# EAGLE schematic openmv-ble (EAGLE 6.1)
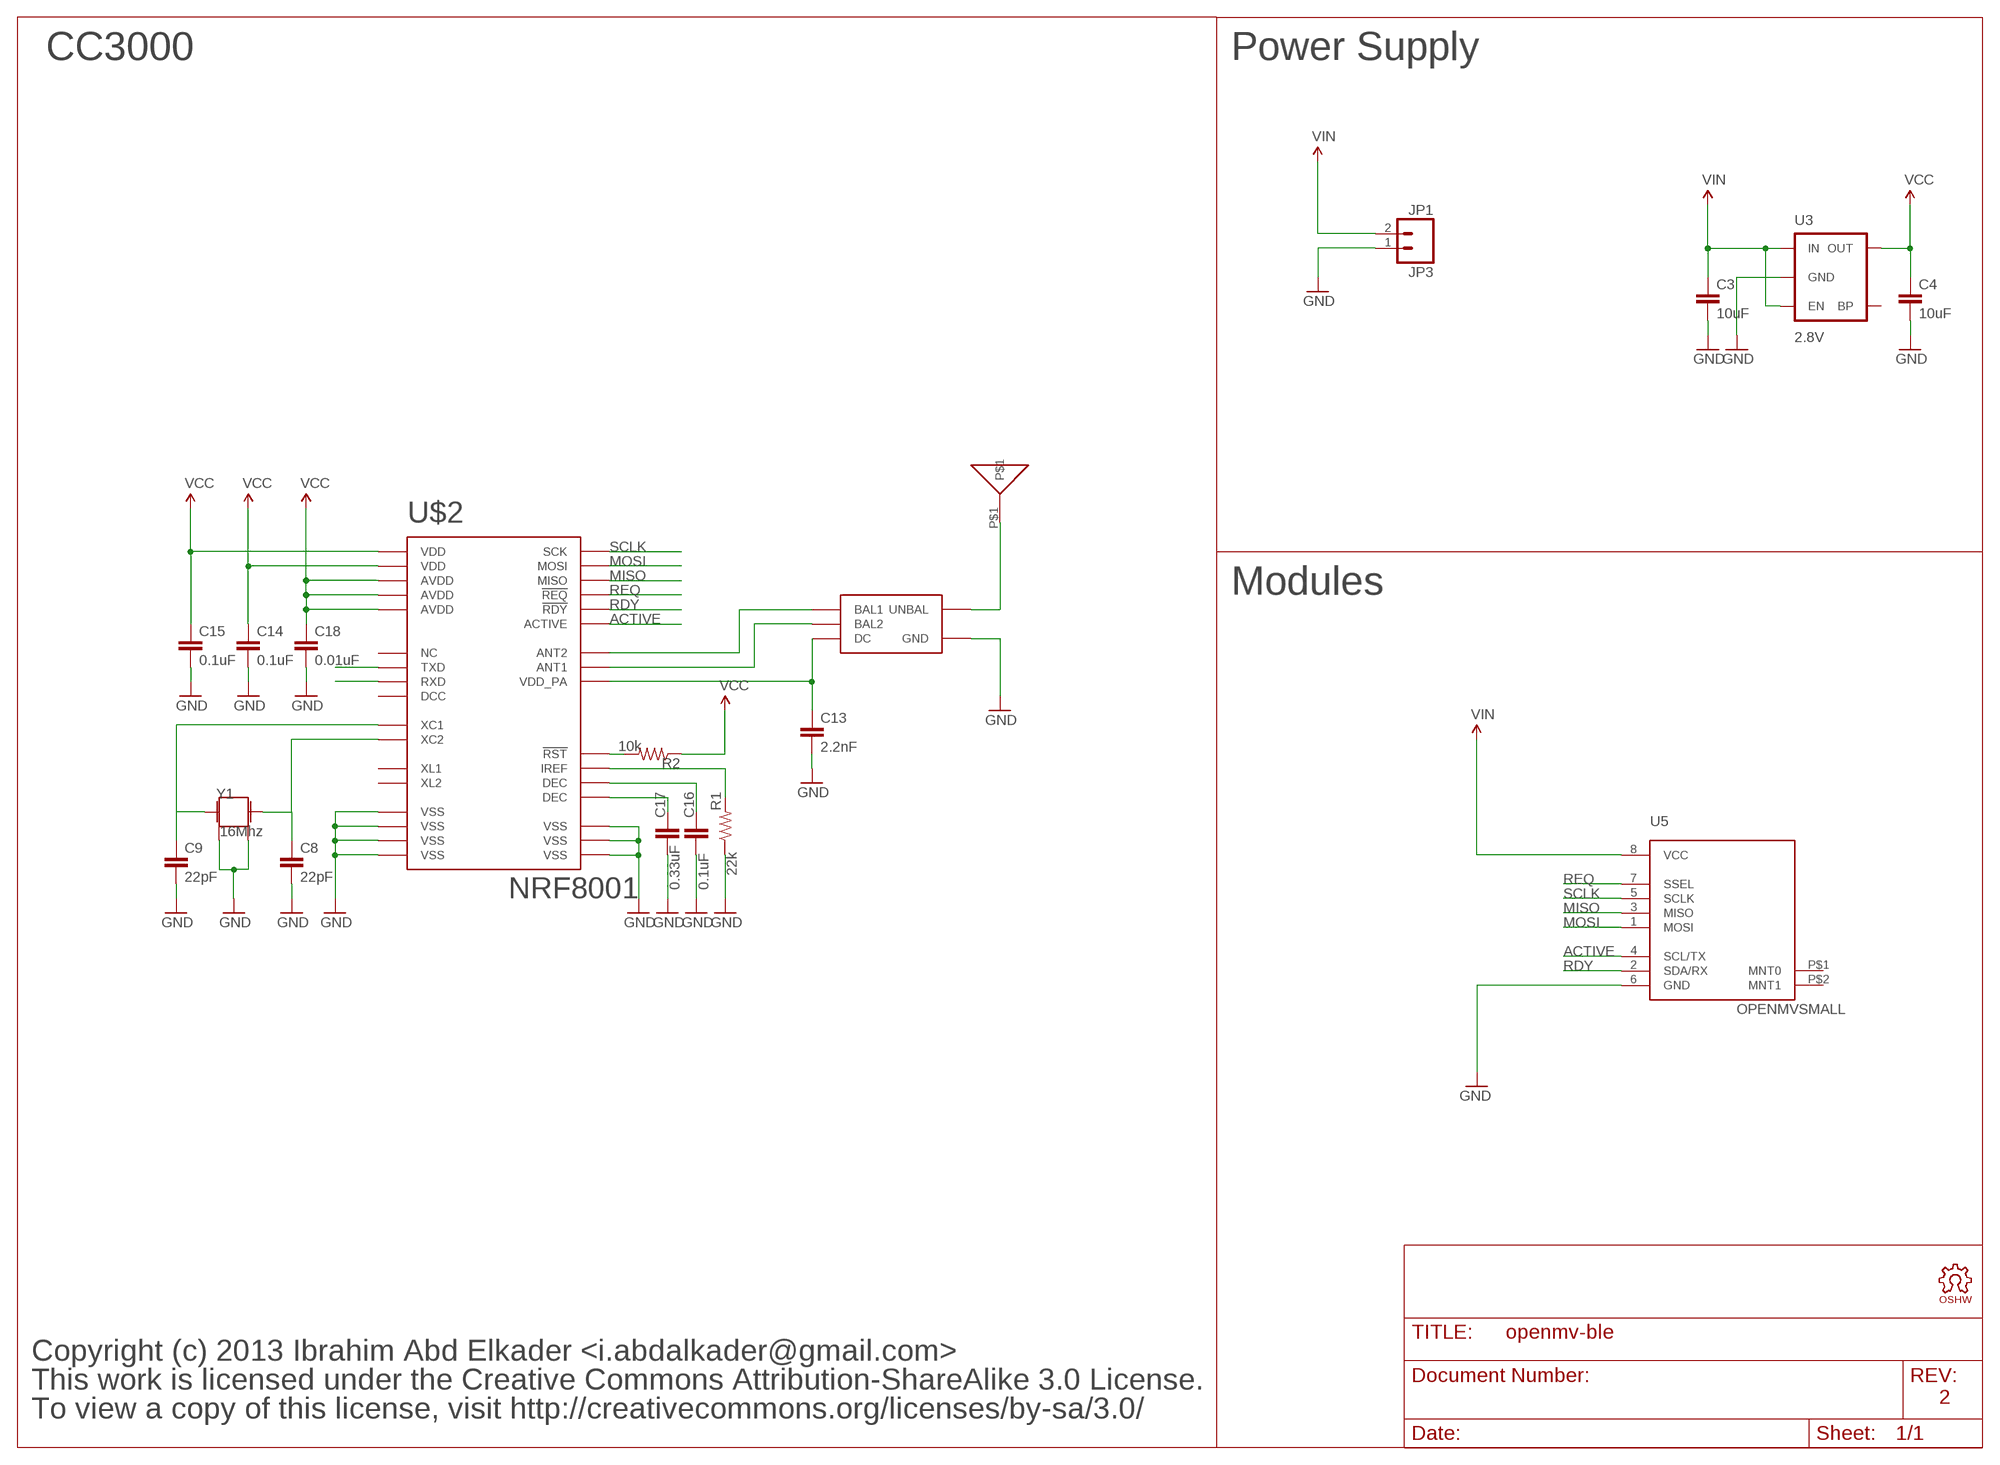
[diagram p0: schematic, sheet 1]

## Parts
C3  10uF  CAP0805  [0805]
C4  10uF  CAP0805  [0805]
C8  22pF  CAP0402-CAP  [0402-CAP]
C9  22pF  CAP0402-CAP  [0402-CAP]
C13  2.2nF  CAP0402-CAP  [0402-CAP]
C14  0.1uF  CAP0402-CAP  [0402-CAP]
C15  0.1uF  CAP0402-CAP  [0402-CAP]
C16  0.1uF  CAP0402-CAP  [0402-CAP]
C17  0.33uF  CAP0402-CAP  [0402-CAP]
C18  0.01uF  CAP0402-CAP  [0402-CAP]
JP1  JP3  M02JST-PTH-2  [JST-2-PTH]
LOGO1  OSHW_LOGO_FILLX0100-NT  [OSHW_FILLX100_NOTEXT]
R1  22k  RESISTOR0402-RES  [0402-RES]
R2  10k  RESISTOR0402-RES  [0402-RES]
U1  2450BM14A0002  [2450BM14A0002]
U2  ANT-YAGEO  [ANTENNA]
U3  2.8V  V_REG_LDOSMD  [SOT23-5]
U5  OPENMVSMALL  [OPENMV-SMALL]
U$2  NRF8001  [QFN-32]
Y1  16Mhz  CRYSTAL3.2X2.5  [CRYSTAL3.2X2.5]

## Nets
ACTIVE: U5.4(SCL/TX) U$2.P$6(ACTIVE)
GND: C3.2 C4.2 C8.2 C9.2 C13.2 C14.2 C15.2 C16.2 C17.2 C18.2 JP1.1 R1.1 U1.P$2(GND) U3.2(GND) U5.6(GND) U$2.P$8(VSS) U$2.P$17(VSS) U$2.P$18(VSS) U$2.P$23(VSS) U$2.P$30(VSS) U$2.P$31(VSS) U$2.P$33(VSS) Y1.2 Y1.4
MISO: U5.3(MISO) U$2.P$14(MISO)
MOSI: U5.1(MOSI) U$2.P$13(MOSI)
N$1: U$2.P$7(TXD)
N$2: C9.1 U$2.P$28(XC1) Y1.3
N$3: U$2.P$10(RXD)
N$7: C8.1 U$2.P$27(XC2) Y1.1
N$8: U1.P$3(BAL1) U$2.P$22(ANT2)
N$10: U1.P$1(UNBAL) U2.P$1
N$11: U1.P$4(BAL2) U$2.P$21(ANT1)
N$12: C13.1 U1.P$5(DC) U$2.P$20(VDD_PA)
N$18: C17.1 U$2.P$2(DEC)
N$19: C16.1 U$2.P$3(DEC)
N$20: R1.2 U$2.P$25(IREF)
N$21: R2.2 U$2.P$19(!RST)
RDY: U5.2(SDA/RX) U$2.P$16(!RDY)
REQ: U5.7(SSEL) U$2.P$12(!REQ)
SCLK: U5.5(SCLK) U$2.P$11(SCK)
VCC: C4.1 C14.1 C15.1 C18.1 R2.1 U3.5(OUT) U$2.P$1(VDD) U$2.P$9(VDD) U$2.P$24(AVDD) U$2.P$26(AVDD) U$2.P$29(AVDD)
VIN: C3.1 JP1.2 U3.1(IN) U3.3(EN) U5.8(VCC)
Unconnected: U1.P$6(NC) U3.4(BP) U5.P$1(MNT0) U5.P$2(MNT1) U$2.P$4(XL2) U$2.P$5(XL1) U$2.P$15(NC)

## Notes on the sheet
- CC3000 | Power Supply
- Modules
- Copyright (c) 2013 Ibrahim Abd Elkader <i.abdalkader@gmail.com>
- This work is licensed under the Creative Commons Attribution-ShareAlike 3.0 License.
- 2
- To view a copy of this license, visit http://creativecommons.org/licenses/by-sa/3.0/

## Power pins joined to a net without a drawn wire
DCC: U$2.P$32(DCC)

## Library data of the parts
C3 C4 C8 C9 C13-C18 = sfe:CAP: Capacitor Standard 0603 ceramic capacitor, and 0.1" leaded capacitor.
JP1 = sfe:M02: Header 2 Standard 2-pin 0.1" header. Use with straight break away headers (SKU : PRT-00116), right angle break away headers (PRT-00553), swiss pins (PRT-00743), machine pins (PRT-00117), and female headers (PRT-00115). Molex polarized connector foot print use with SKU : PRT-08233 with associated crimp pins and housings.
LOGO1 = iofault:OSHW_LOGO_FILL
R1 R2 = sfe:RESISTOR: Resistor Basic schematic elements and footprints for 0603, 1206, and PTH resistors.
U1 = iofault:2450BM14A0002
U2 = CC3000:ANT-YAGEO
U3 = SparkFun:V_REG_LDO: Voltage Regulator LDO Standard 150mA LDO voltage regulator in SOT-23 layout. Micrel part MIC5205. BP (by-pass) pin is used to lower output noise with 470pF cap.
U5 = openmv:OPENMV
U$2 = iofault:NRF8001
Y1 = mux:CRYSTAL: Crystals Various standard crystals. Proven footprints. Spark Fun Electronics SKU : COM-00534

## Net classes
1 vcc: width 1.016 mm, clearance 0.203 mm
2 antenna: width 0.363 mm, clearance 0.305 mm
3 1.8v: width 0.457 mm, clearance 0.254 mm